# Altium schematic sheet adc-analog.SchDoc: ADC - Analog
size Letter; CheckedBy: J. Brinton; CompanyName: Signal Laboratories, Inc.; DrawnBy: J. Brinton; Engineer: J. Brinton; Address1: 3479 Edison Way; Address2: Menlo Park CA 94025; Address3: +1 (877) 778-8435; Address4: siglabs.com; Revision: 3; SheetNumber: 21; SheetTotal: 49; ModifiedDate: 4/20/2018
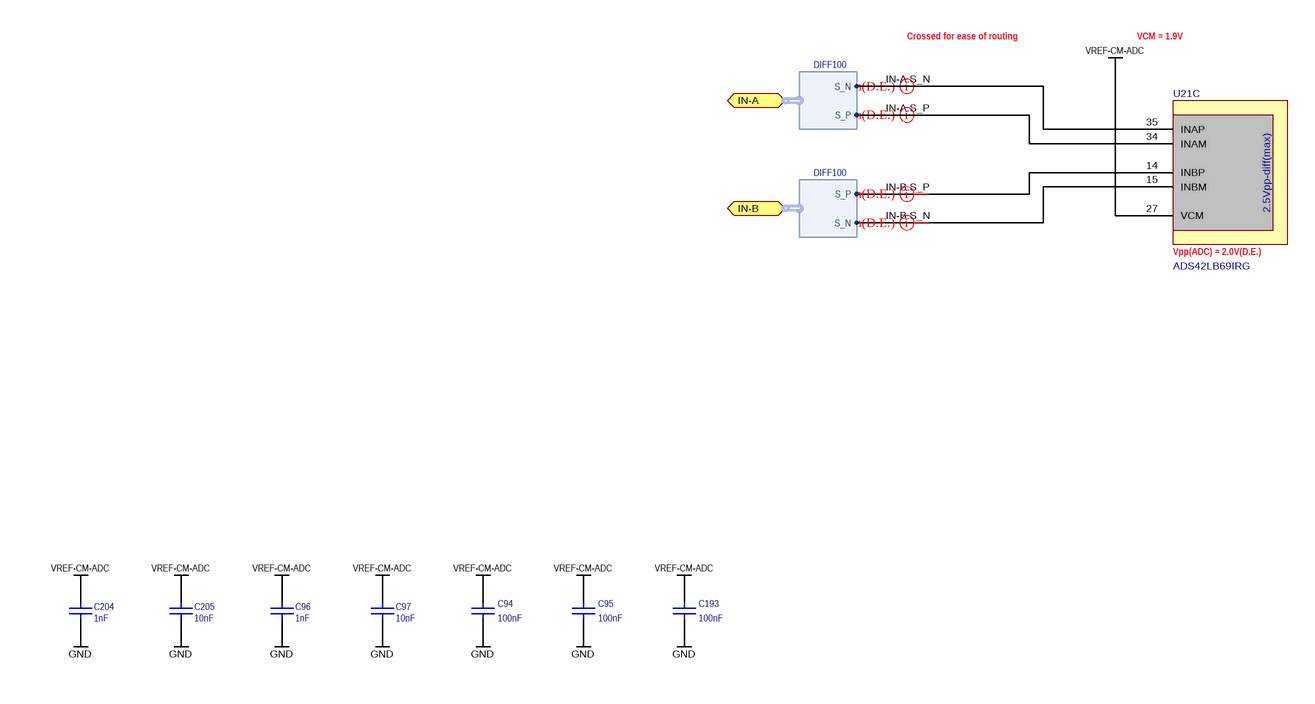
[diagram p0: adc-analog.SchDoc]

## Parts
C94  value 100nF  [CAPC100X50X55L25N]  (hidden comment: GRM155R71C104KA88J)
C95  value 100nF  [CAPC100X50X55L25N]  (hidden comment: GRM155R71C104KA88J)
C96  value 1nF  [CAPC100X50X55L25N]  (hidden comment: CGA2B2NP01H102J050BA)
C97  value 10nF  [CAPC100X50X55L25N]  (hidden comment: GRM155R71H103KA88)
C193  value 100nF  [CAPC100X50X55L25N]  (hidden comment: GRM155R71C104KA88J)
C204  value 1nF  [CAPC100X50X55L25N]  (hidden comment: CGA2B2NP01H102J050BA)
C205  value 10nF  [CAPC100X50X55L25N]  (hidden comment: GRM155R71H103KA88)
U21  ADS42LB69IRG  [S-PVQFN-N64]  (part C of 4)

## Ports
IN-A (harness DIFF100), IN-B (harness DIFF100)

## Harnesses
DIFF100: S_P, S_N

## Nets
GND: C94.2 C95.2 C96.1 C97.1 C193.2 C204.1 C205.1
VREF-CM-ADC: C94.1 C95.1 C96.2 C97.2 C193.1 C204.2 C205.2 U21.27(VCM)
IN-A.S_N: U21.35(INAP) ; port IN-A.S_N
IN-A.S_P: U21.34(INAM) ; port IN-A.S_P
IN-B.S_N: U21.15(INBM) ; port IN-B.S_N
IN-B.S_P: U21.14(INBP) ; port IN-B.S_P

## Layout directives
differential pair; net class z100diff12; Name: 100-Ohm(D.E.): IN-A.S_N, IN-A.S_P, IN-B.S_N, IN-B.S_P

## Notes on the sheet
- Crossed for ease of routing
- VCM = 1.9V
- (near U21) Vpp(ADC) = 2.0V(D.E.)
- Title
- Engineer
- Revision
- Drawn By
- Checked By
- Date
- Sheet
- of
- (in symbol ADS42LB69IRG, part C) 2.5Vpp-diff(max)

## Library data of the parts
C94 C95 C193 = CAP 0402: Ceramic Capacitor 100nF ±10% 16V X7R 0402; Manufacturer: Murata; Tr: -55:125; Voltage: 16V; Manufacturer P/N: GRM155R71C104KA88J; Package: 0402; Tolerance: ±10%
C96 C204 = CAP 0402: Ceramic Capacitor 1nF ±5% 50V NP0 0402; Manufacturer: TDK; Tr: -55:150; Voltage: 50V; Manufacturer P/N: CGA2B2NP01H102J050BA; Package: 0402; Tolerance: ±5%
C97 C205 = CAP 0402: Ceramic Capacitor 10nF ±10% 50V X7R 0402; Manufacturer: Murata; Tr: -55:125; Voltage: 50V; Manufacturer P/N: GRM155R71H103KA88; Package: 0402; Tolerance: ±10%
U21 = ADS42LB69IRG: Dual-Channel, 16-Bit, 250-MSPS Analog-to-Digital Converter; Manufacturer: Texas Instruments; Manufacturer P/N: ADS42LB69IRG